# Altium schematic sheet CO_Output_Processing.SchDoc
size A4
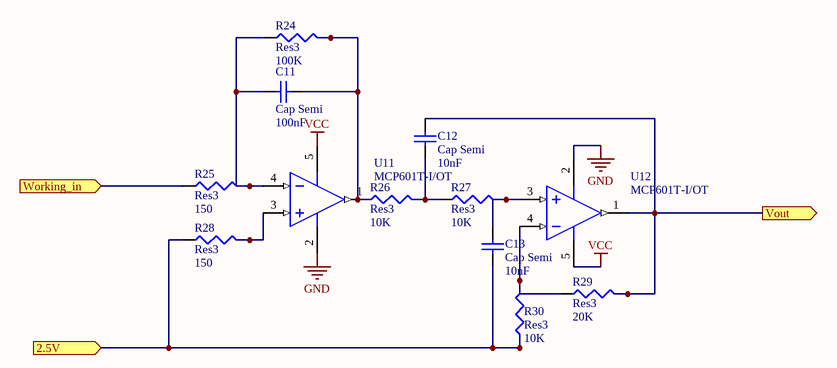
[diagram p0: CO_Output_Processing.SchDoc]

## Parts
C11  Cap Semi  value 100nF  [C1206]
C12  Cap Semi  value 10nF  [C1206]
C13  Cap Semi  value 10nF  [C1206]
R24  Res3  value 100K  [J1-0603]
R25  Res3  value 150  [J1-0603]
R26  Res3  value 10K  [J1-0603]
R27  Res3  value 10K  [J1-0603]
R28  Res3  value 150  [J1-0603]
R29  Res3  value 20K  [J1-0603]
R30  Res3  value 10K  [J1-0603]
U11  MCP601T-I/OT  [SOT-23-OT5_L]
U12  MCP601T-I/OT  [SOT-23-OT5_L]

## Ports
2.5V (in), Vout (out), Working_in (in)

## Nets
GND: U11.2(VSS) U12.2(VSS)
VCC: U11.5(VDD) U12.5(VDD)
2.5V: C13.1 R28.1 R30.1 ; port 2.5V
Vout: C12.2 R29.2 U12.1(VOUT) ; port Vout
Working_in: R25.1 ; port Working_in
NetC11_1: C11.1 R24.1 R25.2 U11.4(VIN-)
NetC11_2: C11.2 R24.2 R26.1 U11.1(VOUT)
NetC12_1: C12.1 R26.2 R27.1
NetC13_2: C13.2 R27.2 U12.3(VIN+)
NetR28_2: R28.2 U11.3(VIN+)
NetR29_1: R29.1 R30.2 U12.4(VIN-)

## Library data of the parts
C11-C13 = Cap Semi: Capacitor (Semiconductor SIM Model); Published: 8-Jun-2000; LatestRevisionDate: 29-May-2009; LatestRevisionNote: IPC-7351 Footprint Added.; PackageReference: C1206; Publisher: Altium Limited; PackageDescription: Chip Capacitor
R24-R30 = Res3: Resistor; Published: 8-Jun-2000; LatestRevisionDate: 29-May-2009; LatestRevisionNote: IPC-7351 Footprint Added.; PackageReference: J1-0603; Publisher: Altium Limited; PackageDescription: Chip Resistor
U11 U12 = CMP-0187-00433-2: 2.7V to 6.0V Single Supply CMOS Operational Amplifier, 5-Pin SOT-23, Industrial Temperature, Tape and Reel; Code_IPC: SOT23-5; ComponentLink3Description: Package Specification; RevisionNote: URLs added.; PackageReference: SOT-23-OT5; ComponentLink3URL: http://www.microchip.com/stellent/groups/techpub_sg/documents/packagingspec/en012702.pdf; ComponentLink1Description: Manufacturer URL; DatasheetVersion: revG, Dec-2007; PackageDescription: 5-Lead Plastic Small Outline Transistor (OT) [SOT-23]; PackageVersion: revBB, Aug-2009; ComponentLink2Description: Datasheet; ComponentLink1URL: http://www.microchip.com/; ComponentLink2URL: http://ww1.microchip.com/downloads/en/DeviceDoc/21314g.pdf